# EAGLE design NodeSmartIrrigation (EAGLE 8.1.0)
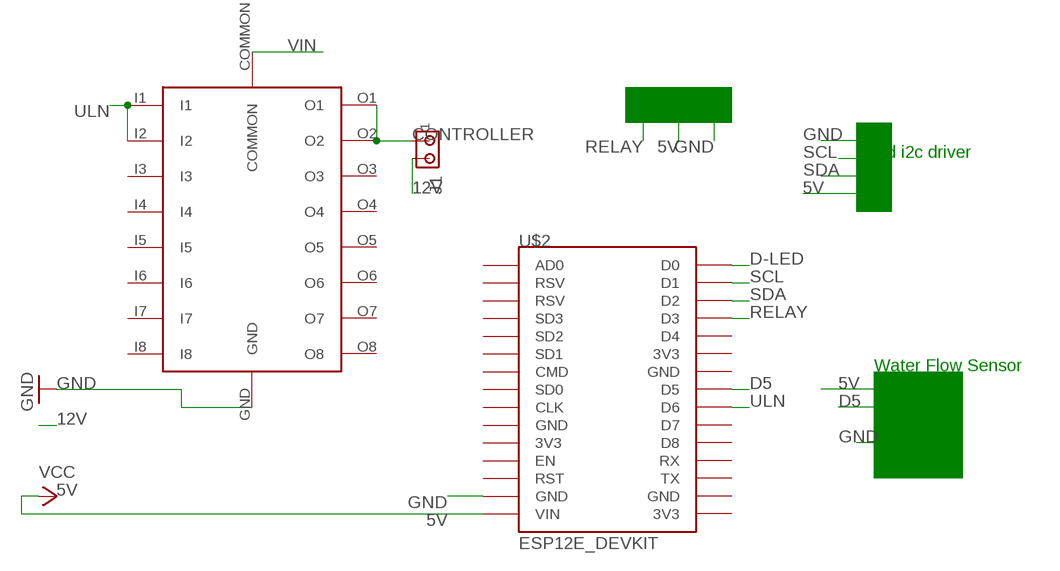
[diagram p0: schematic, sheet 1]

## Parts
J1  MTA02-100  [10X02MTA]
U$1  ULN2803AFWG  [ULN2803AFWG]
U$2  ESP12E_DEVKIT  [ESP12E_DEVKIT]

## Nets
5V: U$2.VIN ; supply symbol labelled VCC
12V: J1.2
CONTROLLER: J1.1 U$1.O1 U$1.O2
D5: U$2.D5
D-LED: U$2.D0
GND: U$1.GND U$2.GND@1(GND)
RELAY: U$2.D3
SCL: U$2.D1
SDA: U$2.D2
ULN: U$1.I1 U$1.I2 U$2.D6
VIN: U$1.COMMON
Unconnected: U$1.I3 U$1.I4 U$1.I5 U$1.I6 U$1.I7 U$1.I8 U$1.O3 U$1.O4 U$1.O5 U$1.O6 U$1.O7 U$1.O8 U$2.3V3@0(3V3) U$2.3V3@1(3V3) U$2.3V3@2(3V3) U$2.AD0 U$2.CLK U$2.CMD U$2.D4 U$2.D7 U$2.D8 U$2.EN U$2.GND@0(GND) U$2.GND@2(GND) U$2.GND@3(GND) U$2.RST U$2.RSV@0(RSV) U$2.RSV@1(RSV) U$2.RX U$2.SD0 U$2.SD1 U$2.SD2 U$2.SD3 U$2.TX

## Notes on the sheet
- lcd i2c driver
- Water Flow Sensor
- DHT | DHT

## Library data of the parts
J1 = con-amp:MTA02-100: AMP connector
U$1 = ULN2803AFWG:ULN2803AFWG; AVAILABILITY: Unavailable; DESCRIPTION: Ic Darl Trans Array Hv 18-Sol - Uln2803afwg(o, El, m; MF: Toshiba; MP: ULN2803AFWG; PACKAGE: SOP-7 Toshiba; PRICE: None
U$2 = ESP12E_DEVKIT:ESP12E_DEVKIT: ESP12E DEVKIT BOARD

## Board
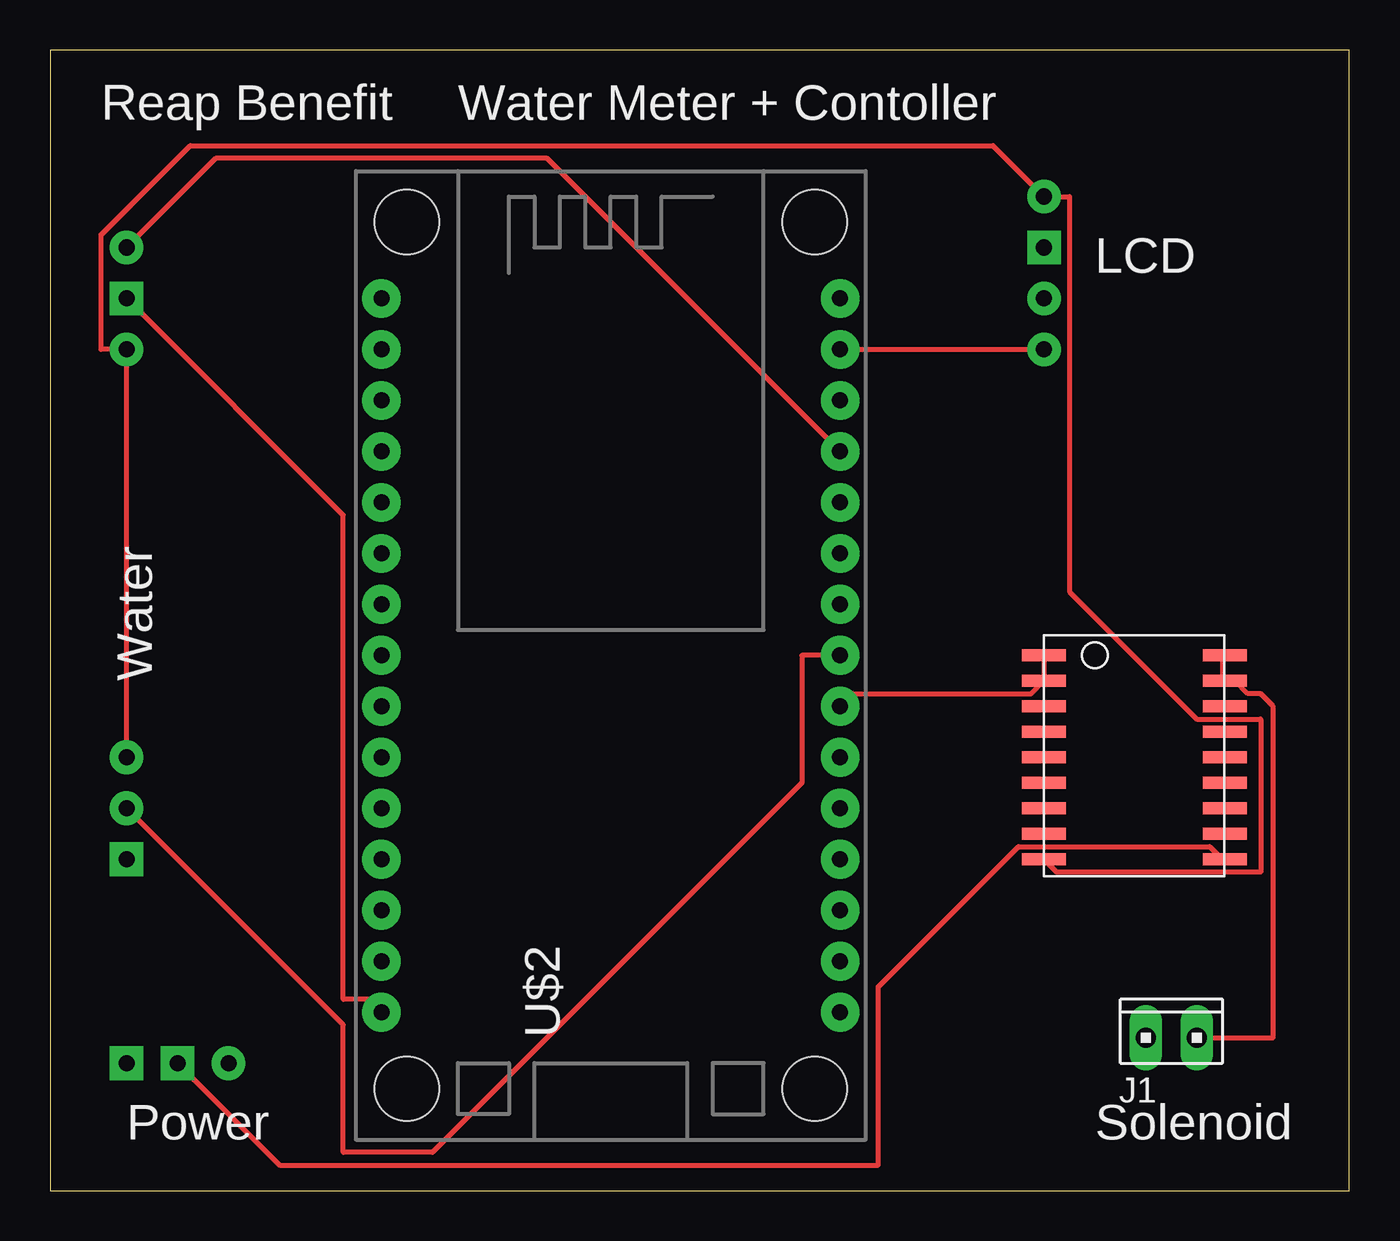
[diagram p1: board, top side]
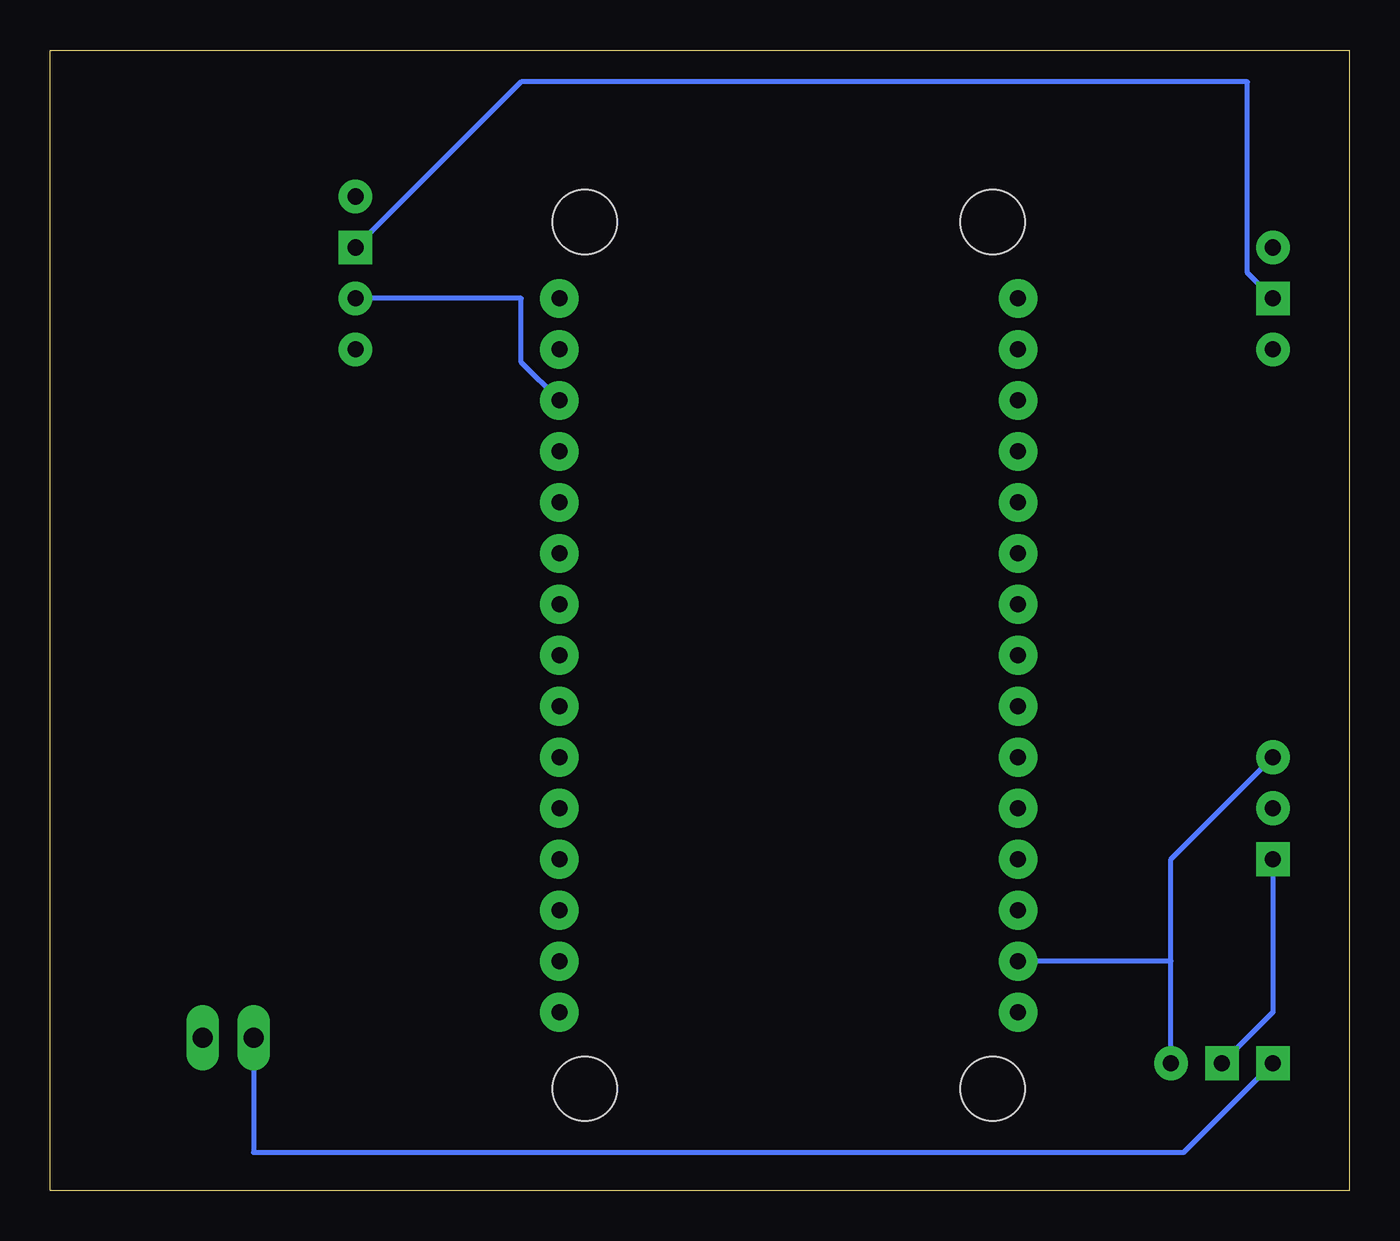
[diagram p2: board, bottom side, seen from below]

Size 64.75 x 56.82 mm. Coordinates in mm from the lower left corner, seen from the top.
Outline: 0,0 64.75,0 64.75,56.82 0,56.82 0,0
Copper layers (1*16): Top 0.035mm / dielectric 1.5mm / Bottom 0.035mm
Design rules "SparkFun": minimum track width 8mil, minimum drill 20mil, track to track 8mil, track to pad 8mil, pad to pad 8mil, via to via 8mil, smd to smd 8mil, copper to edge 8mil, drill to drill 8mil, minimum pad ring 12mil, minimum via ring 10mil, stop-mask expansion 4mil, vias tented up to drill 20mil, thermal gap 10mil

### Footprints (pad centres in the part's own frame; a part is rotated, then mirrored left to right if it is on the bottom)
10X02MTA = drill 1.016 long: 1 1.27,0; 2 -1.27,0
ULN2803AFWG = smd 0.6 x 2.2: COMMON 10.16,9.01; GND 10.16,0; I1 0,0; I2 1.27,0; I3 2.54,0; I4 3.81,0; I5 5.08,0; I6 6.35,0; I7 7.62,0; I8 8.89,0; O1 0,9.01; O2 1.27,9.01; O3 2.54,9.01; O4 3.81,9.01; O5 5.08,9.01; O6 6.35,9.01; O7 7.62,9.01; O8 8.89,9.01
ESP12E_DEVKIT = drill 0.8 pad 1.93: 3V3@0 -11.43,-7.62; 3V3@1 11.43,5.08; 3V3@2 11.43,-17.78; AD0 -11.43,17.78; CLK -11.43,-2.54; CMD -11.43,2.54; D0 11.43,17.78; D1 11.43,15.24; D2 11.43,12.7; D3 11.43,10.16; D4 11.43,7.62; D5 11.43,0; D6 11.43,-2.54; D7 11.43,-5.08; D8 11.43,-7.62; EN -11.43,-10.16; GND@0 -11.43,-5.08; GND@1 -11.43,-15.24; GND@2 11.43,2.54; GND@3 11.43,-15.24; RST -11.43,-12.7; RSV@0 -11.43,15.24; RSV@1 -11.43,12.7; RX 11.43,-10.16; SD0 -11.43,0; SD1 -11.43,5.08; SD2 -11.43,7.62; SD3 -11.43,10.16; TX 11.43,-12.7; VIN -11.43,-17.78 | hole 3.2: -10.16,21.59; 10.16,21.59; 10.16,-21.59; -10.16,-21.59

### Placement (x,y rotation side)
J1  55.88,7.62 0 top
U$1  49.53,26.67 270 top
U$2  27.94,26.67 0 top

### Tracks (layer width: path | path; a pad name or v marks a point on that pad's centre or on a via)
5V  (via drill 0.8 pad 1.68)
  Top 0.254: v3.81,44.45 14.61,33.66 14.61,9.53 15.88,9.53 U$2.VIN
  Bottom 0.254: v49.53,46.99 41.27,55.24 5.08,55.24 5.08,45.72 v3.81,44.45
12V  (via drill 0.8 pad 1.68)
  Bottom 0.254: v3.81,6.35 8.26,1.91 54.61,1.91 J1.2
CONTROLLER
  Top 0.254: U$1.O1 58.42,26.67 58.42,25.4 U$1.O2 59.05,25.4 59.69,24.77 60.33,24.77 60.96,24.13 60.96,7.62 J1.1
D5  (via drill 0.8 pad 1.68)
  Top 0.254: v3.81,19.05 14.61,8.26 14.61,1.91 19.05,1.91 37.47,20.32 37.47,26.67 U$2.D5
GND  (via drill 0.8 pad 1.68)
  Top 0.254: v3.81,21.59 v3.81,41.91 2.54,41.91 2.54,47.62 6.99,52.07 46.99,52.07 v49.53,49.53 50.8,49.53 50.8,29.84 57.15,23.5 60.33,23.5 60.33,15.88 50.16,15.88 U$1.GND
  Bottom 0.254: v3.81,21.59 8.89,16.51 8.89,11.43 | v8.89,6.35 8.89,11.43 | 8.89,11.43 U$2.GND@1
RELAY  (via drill 0.8 pad 1.68)
  Top 0.254: v3.81,46.99 8.26,51.44 24.77,51.44 U$2.D3
SCL  (via drill 0.8 pad 1.68)
  Top 0.254: U$2.D1 v49.53,41.91
SDA  (via drill 0.8 pad 1.68)
  Bottom 0.254: v49.53,44.45 41.27,44.45 41.27,41.27 U$2.D2
ULN
  Top 0.254: U$1.I1 U$1.I2 48.9,24.77 40.01,24.77 U$2.D6
VIN  (via drill 0.8 pad 1.68)
  Top 0.254: v6.35,6.35 11.43,1.27 41.27,1.27 41.27,10.16 48.26,17.14 57.78,17.14 58.42,16.51 U$1.COMMON
  Bottom 0.254: v6.35,6.35 3.81,8.89 v3.81,16.51

### Text on the board
tNames: Reap Benefit | Water Meter + Contoller | LCD | Water | Power | Solenoid